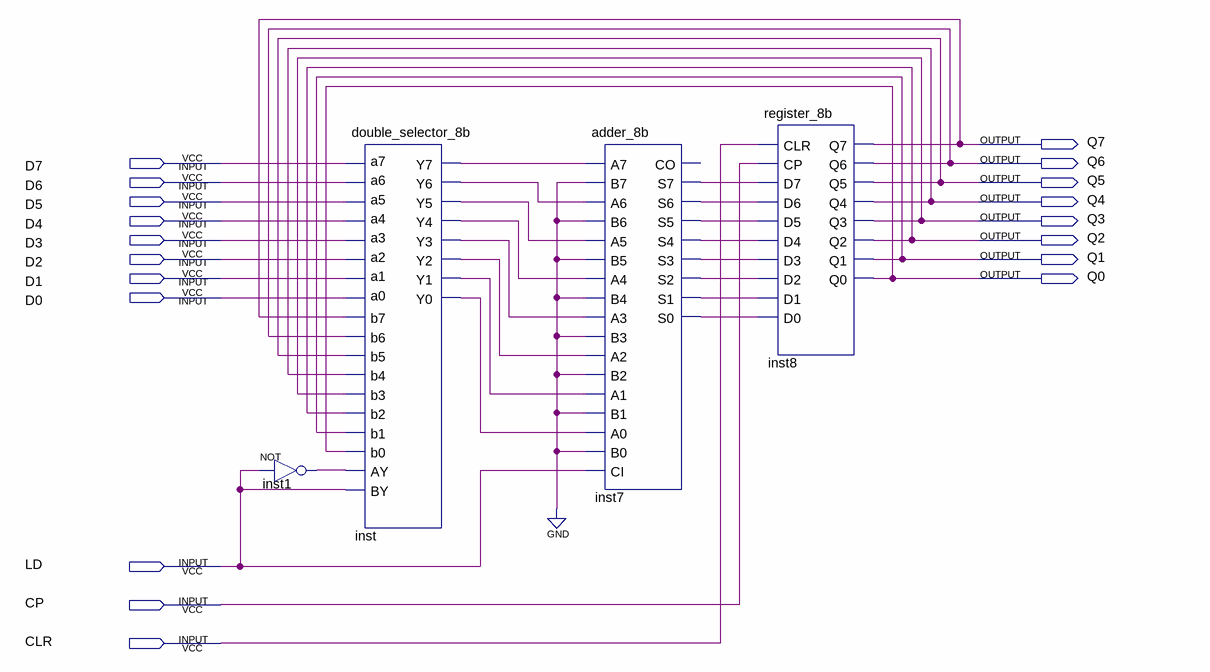
[diagram p0: schematic sheet]
// Quartus schematic counter_8b_with_input.bdf as structural Verilog: 4 symbols, 19 pins
module counter_8b_with_input (
  input  D7,
  input  D6,
  input  D5,
  input  D4,
  input  D3,
  input  D2,
  input  D1,
  input  D0,
  input  LD,
  input  CP,
  input  CLR,
  output Q7,
  output Q6,
  output Q5,
  output Q4,
  output Q3,
  output Q2,
  output Q1,
  output Q0
);

  wire inst1_out, inst7_s0, inst7_s1, inst7_s2, inst7_s3, inst7_s4, inst7_s5, inst7_s6, inst7_s7, inst_y0,
       inst_y1, inst_y2, inst_y3, inst_y4, inst_y5, inst_y6, inst_y7;

  not inst1 (inst1_out, LD);
  double_selector_8b inst (
    .a0(D0), .a1(D1), .a2(D2), .a3(D3), .a4(D4), .a5(D5), .a6(D6), .a7(D7), .b0(Q0), .b1(Q1), .b2(Q2),
    .b3(Q3), .b4(Q4), .b5(Q5), .b6(Q6), .b7(Q7), .AY(inst1_out), .BY(LD), .Y0(inst_y0), .Y1(inst_y1),
    .Y2(inst_y2), .Y3(inst_y3), .Y4(inst_y4), .Y5(inst_y5), .Y6(inst_y6), .Y7(inst_y7));
  adder_8b inst7 (
    .A7(inst_y7), .B7(1'b0), .A6(inst_y6), .B6(1'b0), .A5(inst_y5), .B5(1'b0), .A4(inst_y4), .B4(1'b0),
    .A3(inst_y3), .B3(1'b0), .A2(inst_y2), .B2(1'b0), .A1(inst_y1), .B1(1'b0), .A0(inst_y0), .B0(1'b0),
    .CI(LD), .S7(inst7_s7), .S6(inst7_s6), .S5(inst7_s5), .S4(inst7_s4), .S3(inst7_s3), .S2(inst7_s2),
    .S1(inst7_s1), .S0(inst7_s0));  // open: CO
  register_8b inst8 (
    .CLR(CLR), .CP(CP), .D7(inst7_s7), .D6(inst7_s6), .D5(inst7_s5), .D4(inst7_s4), .D3(inst7_s3),
    .D2(inst7_s2), .D1(inst7_s1), .D0(inst7_s0), .Q7(Q7), .Q6(Q6), .Q5(Q5), .Q4(Q4), .Q3(Q3), .Q2(Q2),
    .Q1(Q1), .Q0(Q0));
endmodule
